# Altium schematic sheet [15] - PWR IN, LEDS, BUTTONS, MECH.SchDoc
size A2; DocumentNumber: 15; SheetNumber: 15; SheetTotal: 18
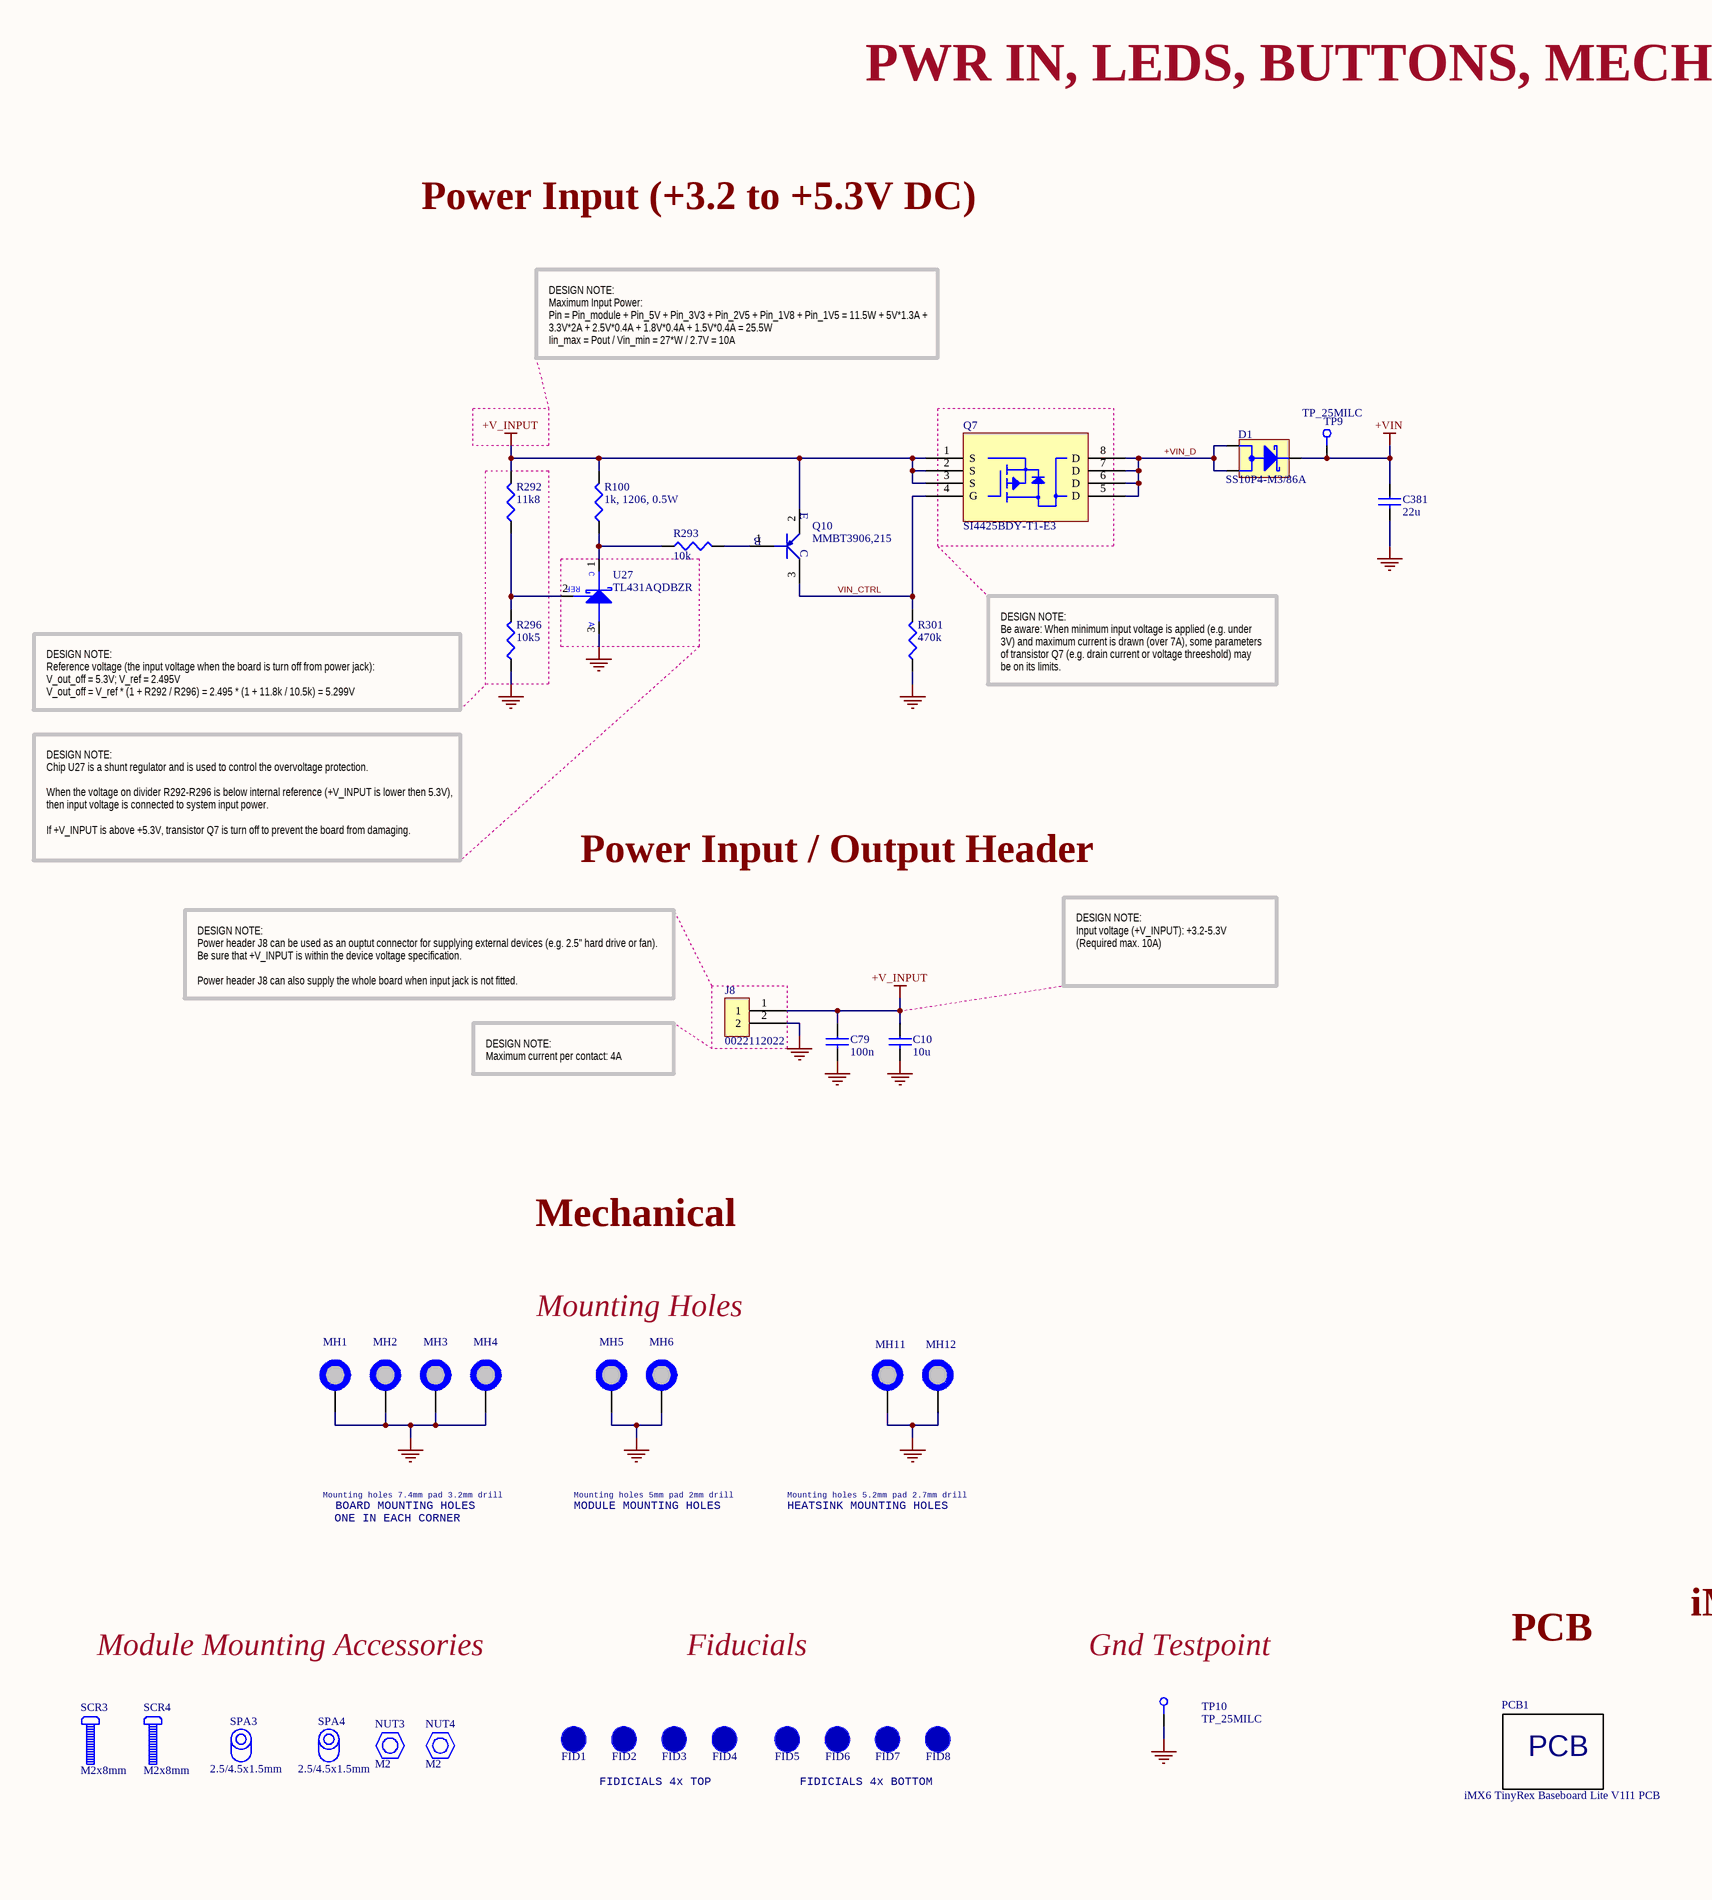
[diagram p0: [15] - PWR IN, LEDS, BUTTONS, MECH.SchDoc, left]
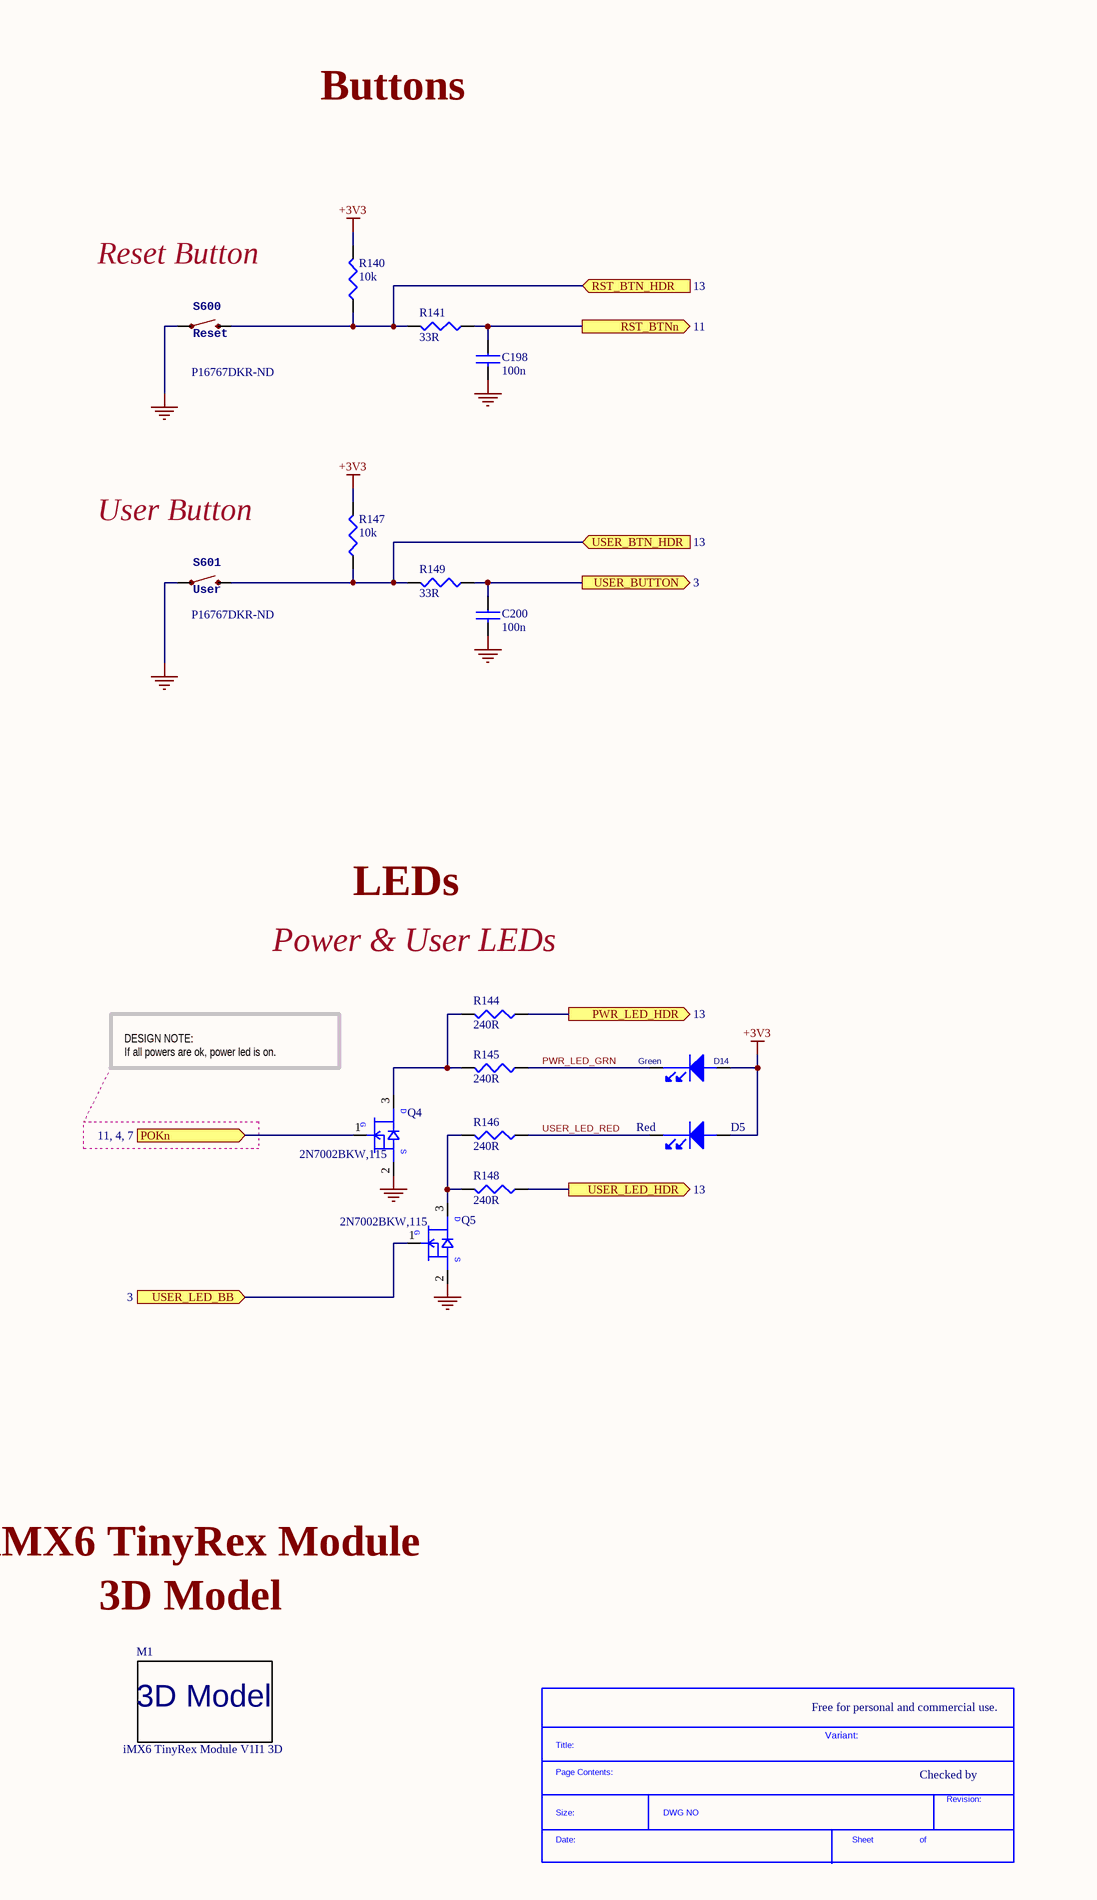
[diagram p1: [15] - PWR IN, LEDS, BUTTONS, MECH.SchDoc, right]

## Parts
*  SDTitleBlock  (value not drawn)  (graphical)
C10  10u  [C0603]
C79  100n  [C0402]
C198  100n  [C0402]
C200  100n  [C0402]
C381  22u  [C0603]
D1  SS10P4-M3/86A  [TO-277A (SMPC)]
D5  Red  [LED_0603]
D14  Green  [LED_0603]
FID1  FID_1MMC  [FID_40X120D]  (value not drawn)  (no BOM)
FID2  FID_1MMC  [FID_40X120D]  (value not drawn)  (no BOM)
FID3  FID_1MMC  [FID_40X120D]  (value not drawn)  (no BOM)
FID4  FID_1MMC  [FID_40X120D]  (value not drawn)  (no BOM)
FID5  FID_1MMC  [FID_40X120D]  (value not drawn)  (no BOM)
FID6  FID_1MMC  [FID_40X120D]  (value not drawn)  (no BOM)
FID7  FID_1MMC  [FID_40X120D]  (value not drawn)  (no BOM)
FID8  FID_1MMC  [FID_40X120D]  (value not drawn)  (no BOM)
J8  0022112022  [HDR_1x2_2.54MM_MOLEX_KK]
M1  iMX6 TinyRex Module V1I1 3D  [iMX6 TinyRex Module 3D]  (no BOM)
MH1  MH_7.4MMC_3.2MMD  [MH_7.4MMD_3.2MMD]  (value not drawn)  (no BOM)
MH2  MH_7.4MMC_3.2MMD  [MH_7.4MMD_3.2MMD]  (value not drawn)  (no BOM)
MH3  MH_7.4MMC_3.2MMD  [MH_7.4MMD_3.2MMD]  (value not drawn)  (no BOM)
MH4  MH_7.4MMC_3.2MMD  [MH_7.4MMD_3.2MMD]  (value not drawn)  (no BOM)
MH5  MH_5MMC_2MMD  [MH_5MMD_2MMD]  (value not drawn)  (no BOM)
MH6  MH_5MMC_2MMD  [MH_5MMD_2MMD]  (value not drawn)  (no BOM)
MH11  MH_5.2MMC_2.7MMD  [MH_5.2MMD_2.7MMD]  (value not drawn)  (no BOM)
MH12  MH_5.2MMC_2.7MMD  [MH_5.2MMD_2.7MMD]  (value not drawn)  (no BOM)
NUT3  M2  [NUT A4 SS M2]
NUT4  M2  [NUT A4 SS M2]
PCB1  iMX6 TinyRex Baseboard Lite V1I1 PCB  (mechanical)
Q4  2N7002BKW,115  [SC70_SOT323]
Q5  2N7002BKW,115  [SC70_SOT323]
Q7  SI4425BDY-T1-E3  [8_SOIC_3.9MM]
Q10  MMBT3906,215  [SOT-23-3-123]
R100  1k, 1206, 0.5W  [R1206]
R140  10k  [R0402]
R141  33R  [R0402]
R144  240R  [R0402]
R145  240R  [R0402]
R146  240R  [R0402]
R147  10k  [R0402]
R148  240R  [R0402]
R149  33R  [R0402]
R292  11k8  [R0402]
R293  10k  [R0402]
R296  10k5  [R0402]
R301  470k  [R0402]
S600  Reset  Supplier Part Number 1: P16767DKR-ND  [EVQP7J01K]
S601  User  Supplier Part Number 1: P16767DKR-ND  [EVQP7J01K]
SCR3  M2x8mm  [SCREW M2x8]
SCR4  M2x8mm  [SCREW M2x8]
SPA3  2.5/4.5x1.5mm  [SPACER 2.5/4.5X1.5MM]
SPA4  2.5/4.5x1.5mm  [SPACER 2.5/4.5X1.5MM]
TP9  TP_25MILC  [TP_25C]  (no BOM)
TP10  TP_25MILC  [TP_25C]  (no BOM)
U27  TL431AQDBZR  [SOT-23-3-123]

## Ports
POKn (see 11, 4, 7), PWR_LED_HDR (out, see 13), RST_BTN_HDR (in, see 13), RST_BTNn (out, see 11), USER_BTN_HDR (in, see 13), USER_BUTTON (out, see 3), USER_LED_BB (in, see 3), USER_LED_HDR (out, see 13)

## Nets
+3V3: D5.2(ANODE) D14.2(ANODE) R140.2 R147.2
+V_INPUT: C10.1 C79.1 J8.1 Q7.1(S) Q7.2(S) Q7.3(S) Q10.2(E) R100.2 R292.2
+VIN: C381.1 D1.3(CATHODE) TP9.1
GND: C10.2 C79.2 C198.2 C200.2 C381.2 J8.2 MH1.1 MH2.1 MH3.1 MH4.1 MH5.1 MH6.1 MH11.1 MH12.1 Q4.2(SOURCE) Q5.2(SOURCE) R296.1 R301.1 S600.A1 S601.A1 TP10.1 U27.3(ANODE)
+VIN_D: D1.1(ANODE1) D1.2(ANODE2) Q7.5(D) Q7.6(D) Q7.7(D) Q7.8(D)
POKn: Q4.1(GATE) ; port POKn
PWR_LED_GRN: D14.1(cathode) R145.1
PWR_LED_HDR: R144.1 ; port PWR_LED_HDR
RST_BTN_HDR: R140.1 R141.2 S600.B3 ; port RST_BTN_HDR
RST_BTNn: C198.1 R141.1 ; port RST_BTNn
USER_BTN_HDR: R147.1 R149.2 S601.B3 ; port USER_BTN_HDR
USER_BUTTON: C200.1 R149.1 ; port USER_BUTTON
USER_LED_BB: Q5.1(GATE) ; port USER_LED_BB
USER_LED_HDR: R148.1 ; port USER_LED_HDR
USER_LED_RED: D5.1(cathode) R146.1
VIN_CTRL: Q7.4(G) Q10.3(C) R301.2
NetQ4_3: Q4.3(DRAIN) R144.2 R145.2
NetQ5_3: Q5.3(DRAIN) R146.2 R148.2
NetQ10_1: Q10.1(B) R293.2
NetR100_1: R100.1 R293.1 U27.1(cathode)
NetR292_1: R292.1 R296.2 U27.2(REF)

## Notes on the sheet
- PWR IN, LEDS, BUTTONS, MECH
- Power Input (+3.2 to +5.3V DC)
- Buttons
- DESIGN NOTE:
  Maximum Input Power:
  Pin = Pin_module + Pin_5V + Pin_3V3 + Pin_2V5 + Pin_1V8 + Pin_1V5 = 11.5W + 5V*1.3A + 3.3V*2A + 2.5V*0.4A + 1.8V*0.4A + 1.5V*0.4A = 25.5W
  Iin_max = Pout / Vin_min = 27*W / 2.7V = 10A
- Reset Button
- DESIGN NOTE:
  Reference voltage (the input voltage when the board is turn off from power jack):
  V_out_off = 5.3V; V_ref = 2.495V
  V_out_off = V_ref * (1 + R292 / R296) = 2.495 * (1 + 11.8k / 10.5k) = 5.299V
- DESIGN NOTE:
  Be aware: When minimum input voltage is applied (e.g. under 3V) and maximum current is drawn (over 7A), some parameters of transistor Q7 (e.g. drain current or voltage threeshold) may be on its limits.
- User Button
- DESIGN NOTE:
  Chip U27 is a shunt regulator and is used to control the overvoltage protection.
  When the voltage on divider R292-R296 is below internal reference (+V_INPUT is lower then 5.3V), then input voltage is connected to system input power.
  If +V_INPUT is above +5.3V, transistor Q7 is turn off to prevent the board from damaging.
- Power Input / Output Header
- DESIGN NOTE:
  Input voltage (+V_INPUT): +3.2-5.3V
  (Required max. 10A)
- DESIGN NOTE:
  Power header J8 can be used as an ouptut connector for supplying external devices (e.g. 2.5'' hard drive or fan). Be sure that +V_INPUT is within the device voltage specification.
  Power header J8 can also supply the whole board when input jack is not fitted.
- LEDs
- DESIGN NOTE:
  Maximum current per contact: 4A
- Power & User LEDs
- DESIGN NOTE:
  If all powers are ok, power led is on.
- Mechanical
- Mounting Holes
- Mounting holes 7.4mm pad 3.2mm drill
- BOARD MOUNTING HOLES
- ONE IN EACH CORNER
- MODULE MOUNTING HOLES
- Mounting holes 5mm pad 2mm drill
- HEATSINK MOUNTING HOLES
- Mounting holes 5.2mm pad 2.7mm drill
- PCB
- iMX6 TinyRex Module
- Module Mounting Accessories
- Fiducials
- Gnd Testpoint
- 3D Model
- Free for personal and commercial use.
- FIDICIALS 4x TOP
- FIDICIALS 4x BOTTOM
- Variant:
- Checked by
- (in symbol 2N7002BKW,115) D; G; S
- (in symbol PCB_iMX6_TinyRex_Baseboard_Lite_V1I1) PCB
- (in symbol SDTitleBlock) Title:; Page Contents:; Revision:; Size:; DWG NO; Date:; Sheet; of
- (in symbol TL431AQDBZR) C; A

## Library data of the parts
C10 = C1608X5R0J106M: CAP CER 10UF 6.3V X5R 20% 0603; Manufacturer: TDK Corporation; Capacitance: 10µF; Value: 10µF; .Checked PCB: used; Category: Capacitors; Supplier Part Number: 445-4112-1-ND; Manufacturer Part Number: C1608X5R0J106M; Operating Temperature: -55°C ~ 85°C; Package / Case: 0603 (1608 Metric); Price 1k [$]: 0.08580; .Checked SCH: used; Voltage - Rated: 6.3V; Features: Low ESR; Supplier: Digikey; Supplier 1: Digi-Key; Supplier Part Number 1: 445-4112-1-ND; RoHS: RoHS Compliant; Stock 1: 48157; Pricing 1: 1=0.46, 10=0.363, 100=0.1898, 250=0.14024, 500=0.1089, 1000=0.0858 (USD); Tolerance: ±20%; Temperature Coefficient: X5R; Mounting Type: Surface Mount, MLCC; Applications: General Purpose; Ratings: -; Size / Dimension: 0.063" L x 0.031" W (1.60mm x 0.80mm); Height - Seated (Max): -; Thickness (Max): 0.037" (0.95mm); Lead Spacing: -; Packaging: Cut Tape (CT); Lead Style: -; ComponentLink1URL: http://www.tdk.com/pdf/general_B11.pdf; ComponentLink1Description: http://www.tdk.com/pdf/general_B11.pdf
C79 C198 C200 = C1005X5R1H104K: CAP CER .10UF 50V X5R 10% 0402; Manufacturer: TDK Corporation; Capacitance: 0.1µF; Value: 100nF; .Checked PCB: used; Category: Capacitors; Supplier Part Number: 445-5942-1-ND; Manufacturer Part Number: C1005X5R1H104K; Operating Temperature: -55°C ~ 85°C; Package / Case: 0402 (1005 Metric); Price 1k [$]: 0.02340; .Checked SCH: used; Voltage - Rated: 50V; Supplier: Digikey; Supplier 1: Digi-Key; Supplier Part Number 1: 445-5942-1-ND; RoHS: RoHS Compliant; Stock 1: 106926; Pricing 1: 1=0.27, 10=0.18, 100=0.072, 250=0.05176, 500=0.0369, 1000=0.027 (USD); Tolerance: ±10%; Temperature Coefficient: X5R; Mounting Type: Surface Mount, MLCC; Applications: General Purpose; Ratings: -; Size / Dimension: 0.039" L x 0.020" W (1.00mm x 0.50mm); Height - Seated (Max): -; Thickness (Max): 0.022" (0.55mm); Lead Spacing: -; Features: -; Packaging: Cut Tape (CT); Lead Style: -; ComponentLink1URL: http://www.tdk.co.jp/tefe02/e412_c.pdf; ComponentLink1Description: http://www.tdk.co.jp/tefe02/e412_c.pdf
C381 = C1608X5R0J226M080AC: CAP CER 22UF 6.3V 20% X5R 0603; Manufacturer: TDK Corporation; Capacitance: 22µF; .Creator: MM; Supplier 1: Digi-Key; Manufacturer Part Number: C1608X5R0J226M080AC; RoHS: RoHS Compliant; Category: Capacitors; Stock 1: 593047; Pricing 1: 1=0.39, 10=0.343, 100=0.1714, 250=0.13708, 500=0.12484, 1000=0.1104 (USD); Packaging: Cut Tape (CT); Tolerance: ±20%; Voltage - Rated: 6.3V; Temperature Coefficient: X5R; Mounting Type: Surface Mount, MLCC; Operating Temperature: -55°C ~ 85°C; Applications: General Purpose; Ratings: -; Package / Case: 0603 (1608 Metric); Size / Dimension: 0.063" L x 0.031" W (1.60mm x 0.80mm); Height - Seated (Max): -; Thickness (Max): 0.039" (1.00mm); Lead Spacing: -; Features: -; Lead Style: -; ComponentLink1URL: http://product.tdk.com/en/catalog/datasheets/mlcc_commercial_general_en.pdf; ComponentLink1Description: http://product.tdk.com/en/catalog/datasheets/mlcc_commercial_general_en.pdf; Supplier Part Number 1: 445-8028-1-ND; .Checked PCB: MM; .Checked SCH: MM
D1 = SS10P4-M3/86A: DIODE SCHOTTKY 40V 10A TO277A; Manufacturer: Vishay Semiconductor Diodes Division; Voltage - Forward (Vf) (Max) @ If: 560mV @ 10A; Speed: Fast Recovery =< 500ns, > 200mA (Io); Current - Reverse Leakage @ Vr: 800µA @ 40V; Capacitance @ Vr, F: 750pF @ 4V, 1MHz; .Checked PCB: MM; Supplier 1: Digi-Key; Manufacturer Part Number: SS10P4-M3/86A; RoHS: RoHS Compliant; Category: Discrete Semiconductor Products; Stock 1: 18662; Pricing 1: 1=0.91, 10=0.796, 25=0.7032, 100=0.613, 250=0.5336, 500=0.45424 (USD); Packaging: Cut Tape (CT); Diode Type: Schottky; Voltage - DC Reverse (Vr) (Max): 40V; Current - Average Rectified (Io): 10A; Reverse Recovery Time (trr): -; Mounting Type: Surface Mount; Package / Case: TO-277, 3-PowerDFN; Supplier Device Package: TO-277A (SMPC); Operating Temperature - Junction: -55°C ~ 150°C; ComponentLink1URL: http://www.vishay.com/docs/88983/ss10p4.pdf; ComponentLink1Description: http://www.vishay.com/docs/88983/ss10p4.pdf; Supplier Part Number 1: SS10P4-M3/86AGICT-ND; .Checked SCH: MM; .Creator: MM
D5 = LS L29K-H1J2-1-Z: LED SMARTLED RED 630NM 0603 SMD; Manufacturer: OSRAM Opto Semiconductors Inc; Millicandela Rating: 4.95mcd; Voltage - Forward (Vf) Typ: 1.8V; Current - Test: 2mA; Wavelength - Peak: 643nm; Viewing Angle: 160°; Lens Type: Diffused; Lens Style/Size: Rectangle with Flat Top, 1.3mm x 0.8mm; Luminous Flux @ Current - Test: 20 mlm; .Checked PCB: used; Supplier 1: Digi-Key; Supplier Part Number 1: 475-1195-1-ND; Manufacturer Part Number: LS L29K-H1J2-1-Z; RoHS: RoHS Compliant; Category: Optoelectronics; Stock 1: 71670; Pricing 1: 1=0.16, 10=0.137, 100=0.1093, 250=0.09564, 500=0.08744 (USD); Color: Red; Wavelength - Dominant: 630nm; Package / Case: 0603 (1608 Metric); Size / Dimension: 1.70mm L x 0.80mm W; Height: 0.65mm; Mounting Type: Surface Mount; Packaging: Cut Tape (CT); ComponentLink1URL: http://catalog.osram-os.com/catalogue/catalogue.do;jsessionid=DB7CFDBAC5AF1E216E45F622E867085A?act=downloadFile&favOid=020000010003f9de000100b6; ComponentLink1Description: http://catalog.osram-os.com/catalogue/catalogue.do;jsessionid=DB7CFDBAC5AF1E216E45F622E867085A?act=downloadFile&favOid=020000010003f9de000100b6; .Checked SCH: used
D14 = LG L29K-G2J1-24-Z: LED SMARTLED GREEN 570NM 0603; Manufacturer: OSRAM Opto Semiconductors Inc; .Checked PCB: used; Current - Test: 2mA; Voltage - Forward (Vf) Typ: 1.7V; Luminous Flux @ Current - Test: 12 mlm; Millicandela Rating: 3.92mcd; Wavelength - Peak: 572nm; Lens Type: Diffused; Lens Style/Size: Rectangle with Flat Top, 1.3mm x 0.8mm; Viewing Angle: 160°; Regulator Topology: Positive Fixed; Voltage - Output: 2.5V; Voltage - Input: 2.6 V ~ 6 V; Voltage - Dropout (Typical): 0.16V @ 500mA; Number of Regulators: 1; Current - Output: 500mA; Current - Limit (Min): 600mA; .Checked SCH: used; Category: Optoelectronics; Family: LEDs - <75mA, Discre; Manufacturer Part Number: LG L29K-G2J1-24-Z; Price 1k [$]: 0.08744; Value: Green; Color: Green; Package / Case: 0603 (1608 Metric); Supplier Part Number: 475-2709-1-ND; Supplier: Digikey; Supplier 1: Digi-Key; Supplier Part Number 1: 475-2709-1-ND; RoHS: RoHS Compliant; Stock 1: 30318; Pricing 1: 1=0.16, 10=0.137, 100=0.1093, 250=0.09564, 500=0.08744 (USD); Wavelength - Dominant: 570nm; Size / Dimension: 1.70mm L x 0.80mm W; Height: 0.65mm; Mounting Type: Surface Mount; Packaging: Cut Tape (CT); ComponentLink1URL: http://catalog.osram-os.com/catalogue/catalogue.do;jsessionid=32CB61882C089EDD4B6D0A54E7E1F117?act=downloadFile&favOid=020000020000138e000100b6; ComponentLink1Description: http://catalog.osram-os.com/catalogue/catalogue.do;jsessionid=32CB61882C089EDD4B6D0A54E7E1F117?act=downloadFile&favOid=020000020000138e000100b6; Operating Temperature: -40°C ~ 125°C; Supplier Device Package: 6-TMLF® (1.6x1.6); ComponentLink2URL: http://www.micrel.com/_PDF/mic5353.pdf; ComponentLink2Description: http://www.micrel.com/_PDF/mic5353.pdf
FID1-FID8 = FID_1MMC: Fiducial 40mil Diameter, 120mil Mask; Supplier: Digikey
J8 = 0022112022: CONN HEADER 2POS .100 VERT GOLD; Manufacturer: Molex, LLC; Connector Type: Header, Unshrouded; Number of Positions: 2; Number of Positions Loaded: All; Pitch: 0.100" (2.54mm); .Creator: MM; .Checked PCB: MM, paper model not checked; Supplier 1: Digi-Key; Manufacturer Part Number: 0022112022; RoHS: RoHS Compliant; Category: Connectors, Interconnects; Stock 1: 30346; Pricing 1: 1=0.38, 10=0.362, 25=0.3104, 50=0.2636, 100=0.2533, 250=0.22748, 500=0.21714, 1000=0.18095, 2500=0.16544 (USD); Packaging: Bulk; Contact Type: Male Pin; Number of Rows: 1; Row Spacing: -; Contact Mating Length: 0.295" (7.49mm); Mounting Type: Through Hole; Termination: Solder; Fastening Type: Friction Lock; Features: -; Contact Finish: Gold; Contact Finish Thickness: 20µin (0.51µm); Color: White; ComponentLink1URL: http://www.molex.com/pdm_docs/sd/022112022_sd.pdf; ComponentLink1Description: http://www.molex.com/pdm_docs/sd/022112022_sd.pdf; Supplier Part Number 1: WM2700-ND; .Checked SCH: MM
M1 = 3D_iMX6_TINYREX_MODULE_V1I1: 3D Model; .Creator: MM; Category: 3D Model
MH1-MH4 = MH_7.4MMC_3.2MMD: Mounting Hole 7.4mm Diameter, 3.2mm Drill; .Creator: MM
MH5 MH6 = MH_5MMC_2MMD: Mounting Hole 5mm Diameter, 2mm Drill; .Creator: MM
MH11 MH12 = MH_5.2MMC_2.7MMD: Mounting Hole 5.2mm Diameter, 2.7mm Drill; .Creator: MM
NUT3 NUT4 = PFP1166: ROEBUCK - PFP1166 - FULL NUT A4 SS M2 (PK 100); Fastener Material: Stainless Steel; .Checked SCH: MM; Category: Hardware, Fasteners, Accessories; Family: Nuts; Manufacturer: ROEBUCK; Manufacturer Part Number: PFP1166; Price 1k [$]: 0.04; Supplier: Farnell; Supplier Part Number: 1552206; Value: M2; Type: Hex; Thread Size: M2; Supplier 1: Farnell; Supplier Part Number 1: 1552206; RoHS: TBA; Stock 1: 19; Pricing 1: 100=0.0624, 500=0.0551, 1000=0.0498, 2500=0.046 (EUR); Thread Size - Metric: M2; Material: Stainless Steel; ComponentLink1URL: http://www.farnell.com/datasheets/1511479.pdf; ComponentLink1Description: http://www.farnell.com/datasheets/1511479.pdf
PCB1 = PCB_iMX6_TinyRex_Baseboard_Lite_V1I1: .Creator: MM; Category: Printed circuits board; .Checked SCH: MM
Q4 Q5 = 2N7002BKW,115: MOSFET N-CH 60V 310MA SOT323; Manufacturer: NXP Semiconductors; FET Type: MOSFET N-Channel, Metal Oxide; FET Feature: Logic Level Gate; Rds On (Max) @ Id, Vgs: 1.6 Ohm @ 500mA, 10V; Vgs(th) (Max) @ Id: 2.1V @ 250µA; Gate Charge (Qg) @ Vgs: 0.6nC @ 4.5V; Input Capacitance (Ciss) @ Vds: 50pF @ 10V; Power - Max: 275mW; .Checked PCB: used; Supplier 1: Digi-Key; Supplier Part Number 1: 568-5980-1-ND; Manufacturer Part Number: 2N7002BKW,115; RoHS: RoHS Compliant; Category: Discrete Semiconductor Products; Stock 1: 15666; Pricing 1: 1=0.39, 10=0.354, 25=0.2548, 100=0.1983, 250=0.12456, 500=0.10616, 1000=0.07233 (USD); Drain to Source Voltage (Vdss): 60V; Current - Continuous Drain (Id) @ 25° C: 310mA; Mounting Type: Surface Mount; Package / Case: SC-70, SOT-323; Supplier Device Package: SC-70; Packaging: Cut Tape (CT); ComponentLink1URL: http://www.nxp.com/documents/data_sheet/2N7002BKW.pdf; ComponentLink1Description: http://www.nxp.com/documents/data_sheet/2N7002BKW.pdf; .Checked SCH: used
Q7 = SI4425BDY-T1-E3: MOSFET P-CH 30V 8.8A 8-SOIC; Manufacturer: Vishay Siliconix; FET Type: MOSFET P-Channel, Metal Oxide; FET Feature: Logic Level Gate; Current - Continuous Drain (Id) @ 25°C: 8.8A (Ta); Rds On (Max) @ Id, Vgs: 12 mOhm @ 11.4A, 10V; Vgs(th) (Max) @ Id: 3V @ 250µA; Gate Charge (Qg) @ Vgs: 100nC @ 10V; Power - Max: 1.5W; .Checked PCB: MM; Supplier 1: Digi-Key; Manufacturer Part Number: SI4425BDY-T1-E3; RoHS: RoHS Compliant; Category: Discrete Semiconductor Products; Stock 1: 26582; Pricing 1: 1=1, 10=0.88, 25=0.7948, 100=0.6955, 250=0.60996, 500=0.54096, 1000=0.4278 (USD); Packaging: Cut Tape (CT); Drain to Source Voltage (Vdss): 30V; Input Capacitance (Ciss) @ Vds: -; Mounting Type: Surface Mount; Package / Case: 8-SOIC (0.154", 3.90mm Width); Supplier Device Package: 8-SO; ComponentLink1URL: http://www.vishay.com/docs/72000/72000.pdf; ComponentLink1Description: http://www.vishay.com/docs/72000/72000.pdf; Supplier Part Number 1: SI4425BDY-T1-E3CT-ND; .Checked SCH: MM; .Creator: MM
Q10 = MMBT3906,215: TRANS PNP 40V 0.2A SOT23; Manufacturer: NXP Semiconductors; Current - Collector (Ic) (Max): 200mA; Vce Saturation (Max) @ Ib, Ic: 400mV @ 5mA, 50mA; DC Current Gain (hFE) (Min) @ Ic, Vce: 100 @ 10mA, 1V; Power - Max: 250mW; Frequency - Transition: 250MHz; .Checked PCB: MM; Supplier 1: Digi-Key; Manufacturer Part Number: MMBT3906,215; RoHS: RoHS Compliant; Category: Discrete Semiconductor Products; Stock 1: 39823; Pricing 1: 1=0.14, 10=0.125, 25=0.1132, 100=0.0816, 250=0.04804, 500=0.03986, 1000=0.02719 (USD); Packaging: Cut Tape (CT); Transistor Type: PNP; Voltage - Collector Emitter Breakdown (Max): 40V; Current - Collector Cutoff (Max): -; Mounting Type: Surface Mount; Package / Case: TO-236-3, SC-59, SOT-23-3; Supplier Device Package: SOT-23 (TO-236AB); ComponentLink1URL: http://www.nxp.com/documents/data_sheet/MMBT3906.pdf; ComponentLink1Description: http://www.nxp.com/documents/data_sheet/MMBT3906.pdf; Supplier Part Number 1: 568-4511-1-ND; .Checked SCH: MM; .Creator: MM
R100 = RNCP1206FTD1K00: RES SMD 1K OHM 1% 1/2W 1206; Manufacturer: Stackpole Electronics Inc; Power (Watts): 0.5W, 1/2W; Temperature Coefficient: ±100ppm/°C; .Checked PCB: MM; Supplier 1: Digi-Key; Manufacturer Part Number: RNCP1206FTD1K00; RoHS: RoHS Compliant; Category: Resistors; Stock 1: 120283; Pricing 1: 1=0.1, 10=0.065, 50=0.0356, 100=0.0271, 250=0.02016, 500=0.01488, 1000=0.00992, 2500=0.00837 (USD); Packaging: Cut Tape (CT); Resistance (Ohms): 1k; Tolerance: ±1%; Composition: Thin Film; Features: Anti-Sulfur; Operating Temperature: -55°C ~ 155°C; Package / Case: 1206 (3216 Metric); Supplier Device Package: 1206; Size / Dimension: 0.122" L x 0.059" W (3.10mm x 1.50mm); Height: 0.024" (0.60mm); Number of Terminations: 2; ComponentLink1URL: http://www.seielect.com/catalog/SEI-RNCP.pdf; ComponentLink1Description: http://www.seielect.com/catalog/SEI-RNCP.pdf; Supplier Part Number 1: RNCP1206FTD1K00CT-ND; .Checked SCH: MM; .Creator: MM
R140 R147 R293 = RC0402FR-0710KL: RES 10.0K OHM 1/16W 1% 0402 SMD; Manufacturer: Yageo; Power (Watts): 0.063W, 1/16W; .Checked PCB: used; Temperature Coefficient: ±100ppm/°C; Category: Resistors; Supplier Part Number: 311-10.0KLRCT-ND; Manufacturer Part Number: RC0402FR-0710KL; Package / Case: 0402 (1005 Metric); Price 1k [$]: 0.01421; Resistance (Ohms): 10K; Tolerance: ±1%; Value: 10k; .Checked SCH: used; Supplier: Digikey; Supplier 1: Digi-Key; Supplier Part Number 1: 311-10.0KLRCT-ND; RoHS: RoHS Compliant; Stock 1: 2916495; Pricing 1: 10=0.014, 50=0.0104, 100=0.0079, 250=0.00584, 500=0.00432, 1000=0.00288 (USD); Composition: Thick Film; Features: -; Size / Dimension: 0.039" L x 0.020" W (1.00mm x 0.50mm); Height: 0.016" (0.40mm); Number of Terminations: 2; Packaging: Cut Tape (CT); ComponentLink1URL: http://www.yageo.com/documents/recent/PYu-RC0402_51_RoHS_L_6.pdf; ComponentLink1Description: http://www.yageo.com/documents/recent/PYu-RC0402_51_RoHS_L_6.pdf
R141 R149 = RMCF0402FT33R0: RES TF 33 OHM 1% 1/16W 0402; Manufacturer: Stackpole Electronics Inc; Resistance (Ohms): 33; Power (Watts): 0.063W, 1/16W; .Checked PCB: used; Temperature Coefficient: ±100ppm/°C; Category: Resistors; Supplier Part Number: RMCF0402FT33R0CT-ND; Manufacturer Part Number: RMCF0402FT33R0; Package / Case: 0402 (1005 Metric); Price 1k [$]: 0.00384; Tolerance: ±1%; Value: 33R; .Checked SCH: used; Supplier: Digikey; Supplier 1: Digi-Key; Supplier Part Number 1: RMCF0402FT33R0CT-ND; RoHS: RoHS Compliant; Stock 1: 26866; Pricing 1: 1=0.04, 10=0.025, 50=0.0138, 100=0.0105, 250=0.0078, 500=0.00576, 1000=0.00384 (USD); Composition: Thick Film; Features: -; Size / Dimension: 0.039" L x 0.020" W (1.00mm x 0.50mm); Height: 0.016" (0.40mm); Number of Terminations: 2; Packaging: Cut Tape (CT); ComponentLink1URL: http://www.seielect.com/Catalog/SEI-RMCF.pdf; ComponentLink1Description: http://www.seielect.com/Catalog/SEI-RMCF.pdf
R144-R146 R148 = RMCF0402FT240R: RES TF 240 OHM 1% 0.0625W 0402; Manufacturer: Stackpole Electronics Inc; Resistance (Ohms): 240; Power (Watts): 0.063W, 1/16W; .Checked PCB: used; Temperature Coefficient: ±100ppm/°C; Category: Resistors; Supplier Part Number: RMCF0402FT240RCT-ND; Manufacturer Part Number: RMCF0402FT240R; Package / Case: 0402 (1005 Metric); Price 1k [$]: 0.00384; Tolerance: ±1%; Value: 240R; .Checked SCH: used; Supplier: Digikey; Supplier 1: Digi-Key; Supplier Part Number 1: RMCF0402FT240RCT-ND; RoHS: RoHS Compliant; Stock 1: 39860; Pricing 1: 1=0.04, 10=0.025, 50=0.0138, 100=0.0105, 250=0.0078, 500=0.00576, 1000=0.00384 (USD); Composition: Thick Film; Features: -; Size / Dimension: 0.039" L x 0.020" W (1.00mm x 0.50mm); Height: 0.016" (0.40mm); Number of Terminations: 2; Packaging: Cut Tape (CT); ComponentLink1URL: http://www.seielect.com/Catalog/SEI-RMCF.pdf; ComponentLink1Description: http://www.seielect.com/Catalog/SEI-RMCF.pdf
R292 = CRCW040211K8FKED: RES 11.8K OHM 1/16W 1% 0402 SMD; Manufacturer: Vishay Dale; Power (Watts): 0.063W, 1/16W; Temperature Coefficient: ±100ppm/°C; .Checked PCB: RF; Supplier 1: Digi-Key; Supplier Part Number 1: 541-11.8KLCT-ND; Manufacturer Part Number: CRCW040211K8FKED; RoHS: RoHS Compliant; Category: Resistors; Stock 1: 30358; Pricing 1: 10=0.083, 50=0.0444, 200=0.0255, 1000=0.0174 (USD); Resistance (Ohms): 11.8K; Composition: Thick Film; Features: -; Tolerance: ±1%; Package / Case: 0402 (1005 Metric); Size / Dimension: 0.039" L x 0.020" W (1.00mm x 0.50mm); Height: 0.016" (0.40mm); Number of Terminations: 2; Packaging: Cut Tape (CT); ComponentLink1URL: http://www.vishay.com/doc?20035; ComponentLink1Description: http://www.vishay.com/doc?20035; .Checked SCH: RF
R296 = CRCW040210K5FKED: RES 10.5K OHM 1/16W 1% 0402 SMD; Manufacturer: Vishay/Dale; Power (Watts): 0.063W, 1/16W; .Checked PCB: used; Temperature Coefficient: ±100ppm/°C; Category: Resistors; Supplier Part Number: 541-10.5KLCT-ND; Manufacturer Part Number: CRCW040210K5FKED; Package / Case: 0402 (1005 Metric); Price 1k [$]: 0.01740; Resistance (Ohms): 10.5K; Tolerance: ±1%; Value: 10k5; .Checked SCH: used; Supplier: Digikey; Supplier 1: Digi-Key; Supplier Part Number 1: 541-10.5KLCT-ND; RoHS: RoHS Compliant; Stock 1: 36157; Pricing 1: 10=0.083, 50=0.0444, 200=0.0255, 1000=0.0174 (USD); Composition: Thick Film; Features: -; Size / Dimension: 0.039" L x 0.020" W (1.00mm x 0.50mm); Height: 0.016" (0.40mm); Number of Terminations: 2; Packaging: Cut Tape (CT); ComponentLink1URL: http://www.vishay.com/doc?20035; ComponentLink1Description: http://www.vishay.com/doc?20035
R301 = CRCW0402470KFKED: RES 470K OHM 1/16W 1% 0402 SMD; Manufacturer: Vishay Dale; Power (Watts): 0.063W, 1/16W; Temperature Coefficient: ±100ppm/°C; .Checked PCB: MM; Supplier 1: Digi-Key; Supplier Part Number 1: 541-470KLCT-ND; Manufacturer Part Number: CRCW0402470KFKED; RoHS: RoHS Compliant; Category: Resistors; Stock 1: 9270; Pricing 1: 10=0.083, 50=0.0444, 200=0.0255, 1000=0.0174 (USD); Resistance (Ohms): 470K; Composition: Thick Film; Features: -; Tolerance: ±1%; Size / Dimension: 0.039" L x 0.020" W (1.00mm x 0.50mm); Height: 0.016" (0.40mm); Number of Terminations: 2; Packaging: Cut Tape (CT); Package / Case: 0402 (1005 Metric); ComponentLink1URL: http://www.vishay.com/doc?20035; ComponentLink1Description: http://www.vishay.com/doc?20035; .Checked SCH: MM
S600 S601 = SWITCH-MOMENTARY-2: Supplier 1: Digi-Key
SCR3 SCR4 = MPMS 002 0008 PH: MACHINE SCREW PAN PHILLIPS M2; Manufacturer: B&F Fastener Supply; Screw Head Type: Pan Head; Head Diameter: 0.152" (3.85mm); Head Height: 0.060" (1.52mm); Plating: Zinc; .Creator: MM; Supplier 1: Digi-Key; Manufacturer Part Number: MPMS 002 0008 PH; RoHS: RoHS Compliant; Category: Hardware, Fasteners, Accessories; Stock 1: 74600; Pricing 1: 100=0.0705, 1000=0.0564 (USD); Type: Machine Screw; Drive Type: Phillips; Features: -; Thread Size: M2; Length - Below Head: 0.315" (8.00mm); Length - Overall: 0.375" (9.53mm) 3/8"; Material: -; ComponentLink1URL: http://www.fasnetdirect.com/refguide/MetD7985a.pdf; ComponentLink1Description: http://www.fasnetdirect.com/refguide/MetD7985a.pdf; Supplier Part Number 1: H739-ND; .Checked SCH: MM
SPA3 SPA4 = SPACER 2.5/4.5X1.5MM: .Creator: MM; Category: Spacer; .Checked SCH: MM
TP9 TP10 = TP_25MILC: Test Point 25mil
U27 = TL431AQDBZR: IC VREF SHUNT ADJ SOT23-3; Manufacturer: Texas Instruments; Output Type: Adjustable; Voltage - Output (Min/Fixed): 2.495V; Voltage - Output (Max): 36V; Current - Output: 100mA; Tolerance: ±1%; Current - Cathode: 700µA; .Checked PCB: MM; Supplier 1: Digi-Key; Manufacturer Part Number: TL431AQDBZR; RoHS: RoHS Compliant; Category: Integrated Circuits (ICs); Stock 1: 14090; Pricing 1: 1=0.48, 10=0.323, 100=0.151, 1000=0.131 (USD); Packaging: Cut Tape (CT); Reference Type: Shunt; Temperature Coefficient: -; Noise - 0.1Hz to 10Hz: -; Noise - 10Hz to 10kHz: -; Voltage - Input: -; Current - Supply: -; Operating Temperature: -40°C ~ 125°C (TA); Mounting Type: Surface Mount; Package / Case: TO-236-3, SC-59, SOT-23-3; Supplier Device Package: SOT-23-3; ComponentLink1URL: http://www.ti.com/lit/ds/symlink/tl431a.pdf; ComponentLink1Description: http://www.ti.com/lit/ds/symlink/tl431a.pdf; Supplier Part Number 1: 296-18864-1-ND; .Checked SCH: MM; .Creator: MM